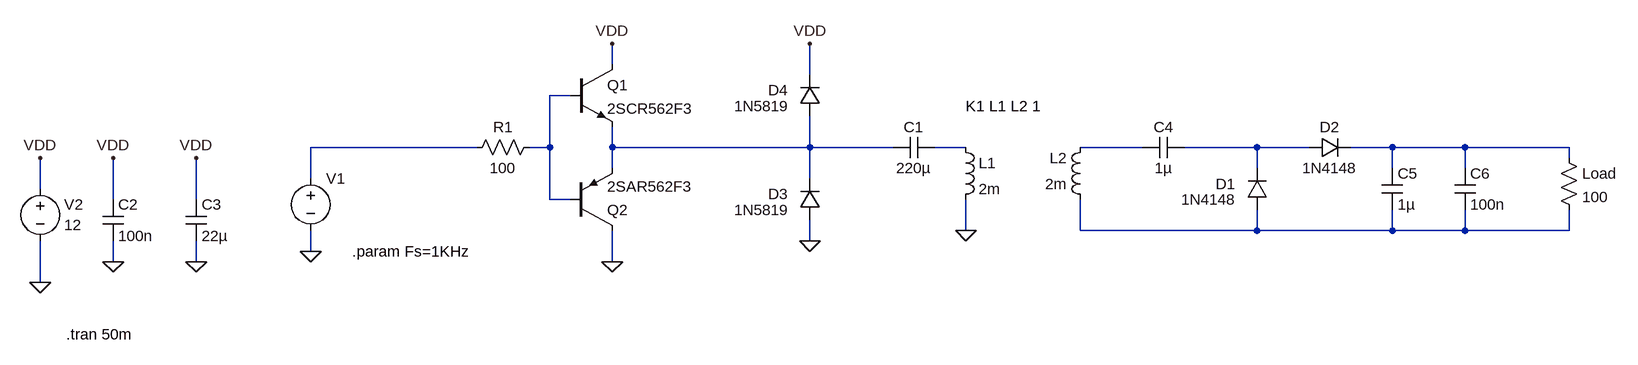
[diagram p0: schematic v1.0.asc]
v1.0.asc, the LTspice schematic file:
Version 4.1
SHEET 1 1852 680
WIRE 288 -32 288 -64
WIRE 592 -16 592 -64
WIRE 224 16 192 16
WIRE 80 96 -176 96
WIRE 192 96 192 16
WIRE 192 96 160 96
WIRE 288 96 288 64
WIRE 592 96 592 48
WIRE 592 96 288 96
WIRE 720 96 592 96
WIRE 832 96 784 96
WIRE 1104 96 1008 96
WIRE 1280 96 1168 96
WIRE 1360 96 1280 96
WIRE 1488 96 1424 96
WIRE 1600 96 1488 96
WIRE 1760 96 1600 96
WIRE 1760 112 1760 96
WIRE 288 128 288 96
WIRE 1280 128 1280 96
WIRE 1488 128 1488 96
WIRE 1600 128 1600 96
WIRE -176 144 -176 96
WIRE 592 144 592 96
WIRE -592 160 -592 112
WIRE -480 176 -480 112
WIRE -352 176 -352 112
WIRE 192 176 192 96
WIRE 224 176 192 176
WIRE 832 224 832 176
WIRE 1008 224 1008 176
WIRE 1280 224 1280 192
WIRE 1280 224 1008 224
WIRE 1488 224 1488 192
WIRE 1488 224 1280 224
WIRE 1600 224 1600 192
WIRE 1600 224 1488 224
WIRE 1760 224 1760 192
WIRE 1760 224 1600 224
WIRE 592 240 592 208
WIRE -176 256 -176 224
WIRE -480 272 -480 240
WIRE -352 272 -352 240
WIRE 288 272 288 224
WIRE -592 304 -592 240
FLAG -176 256 0
FLAG 832 224 0
FLAG -352 112 VDD
FLAG -592 304 0
FLAG 288 -64 VDD
FLAG 288 272 0
FLAG -480 112 VDD
FLAG -480 272 0
FLAG -352 272 0
FLAG -592 112 VDD
FLAG 592 240 0
FLAG 592 -64 VDD
SYMBOL voltage -176 128 R0
WINDOW 3 24 96 Invisible 2
WINDOW 123 0 0 Left 0
WINDOW 39 0 0 Left 0
SYMATTR Value PULSE(0 12 0 {0.01/Fs} {0.01/Fs} {0.5/Fs} {1/Fs})
SYMATTR InstName V1
SYMBOL npn 224 -32 R0
SYMATTR InstName Q1
SYMATTR Value 2SCR562F3
SYMBOL pnp 224 224 M180
SYMATTR InstName Q2
SYMATTR Value 2SAR562F3
SYMBOL res 176 80 R90
WINDOW 0 0 56 VBottom 2
WINDOW 3 32 56 VTop 2
SYMATTR InstName R1
SYMATTR Value 100
SYMBOL cap 784 80 R90
WINDOW 0 0 32 VBottom 2
WINDOW 3 32 32 VTop 2
SYMATTR InstName C1
SYMATTR Value 220µ
SYMBOL ind 816 80 R0
SYMATTR InstName L1
SYMATTR Value 2m
SYMATTR Type ind
SYMBOL voltage -592 144 R0
WINDOW 0 37 40 Left 2
WINDOW 3 37 71 Left 2
WINDOW 123 0 0 Left 0
WINDOW 39 0 0 Left 0
SYMATTR InstName V2
SYMATTR Value 12
SYMBOL cap -496 176 R0
SYMATTR InstName C2
SYMATTR Value 100n
SYMBOL cap -368 176 R0
SYMATTR InstName C3
SYMATTR Value 22µ
SYMBOL ind 1024 192 R180
WINDOW 0 36 80 Left 2
WINDOW 3 36 40 Left 2
SYMATTR InstName L2
SYMATTR Value 2m
SYMATTR Type ind
SYMBOL cap 1168 80 R90
WINDOW 0 0 32 VBottom 2
WINDOW 3 32 32 VTop 2
SYMATTR InstName C4
SYMATTR Value 1µ
SYMBOL diode 1296 192 R180
WINDOW 0 49 40 Left 2
WINDOW 3 48 16 Left 2
SYMATTR InstName D1
SYMATTR Value 1N4148
SYMBOL diode 1360 112 R270
WINDOW 0 32 32 VTop 2
WINDOW 3 0 32 VBottom 2
SYMATTR InstName D2
SYMATTR Value 1N4148
SYMBOL cap 1472 128 R0
SYMATTR InstName C5
SYMATTR Value 1µ
SYMBOL cap 1584 128 R0
SYMATTR InstName C6
SYMATTR Value 100n
SYMBOL res 1744 96 R0
SYMATTR InstName Load
SYMATTR Value 100
SYMBOL diode 608 208 R180
WINDOW 0 49 40 Left 2
WINDOW 3 48 16 Left 2
SYMATTR InstName D3
SYMATTR Value 1N5819
SYMBOL diode 608 48 R180
WINDOW 0 49 40 Left 2
WINDOW 3 48 16 Left 2
SYMATTR InstName D4
SYMATTR Value 1N5819
TEXT -112 256 Left 2 !.param Fs=1KHz
TEXT -552 384 Left 2 !.tran 50m
TEXT 832 32 Left 2 !K1 L1 L2 1

The netlist it stands for:
* v1.0.asc
V1 N002 0 PULSE(0 12 0 {0.01/Fs} {0.01/Fs} {0.5/Fs} {1/Fs})
Q1 VDD N001 N003 0 2SCR562F3
Q2 0 N001 N003 0 2SAR562F3
R1 N001 N002 100
C1 N004 N003 220µ
L1 N004 0 2m
V2 VDD 0 12
C2 VDD 0 100n
C3 VDD 0 22µ
L2 N008 N005 2m
C4 N006 N005 1µ
D1 N008 N006 1N4148
D2 N006 N007 1N4148
C5 N007 N008 1µ
C6 N007 N008 100n
R§Load N007 N008 100
D3 0 N003 1N5819
D4 N003 VDD 1N5819
.model D D
.lib standard.dio
.model NPN NPN
.model PNP PNP
.lib standard.bjt
.param Fs=1KHz
.tran 50m
K1 L1 L2 1
.backanno
.end